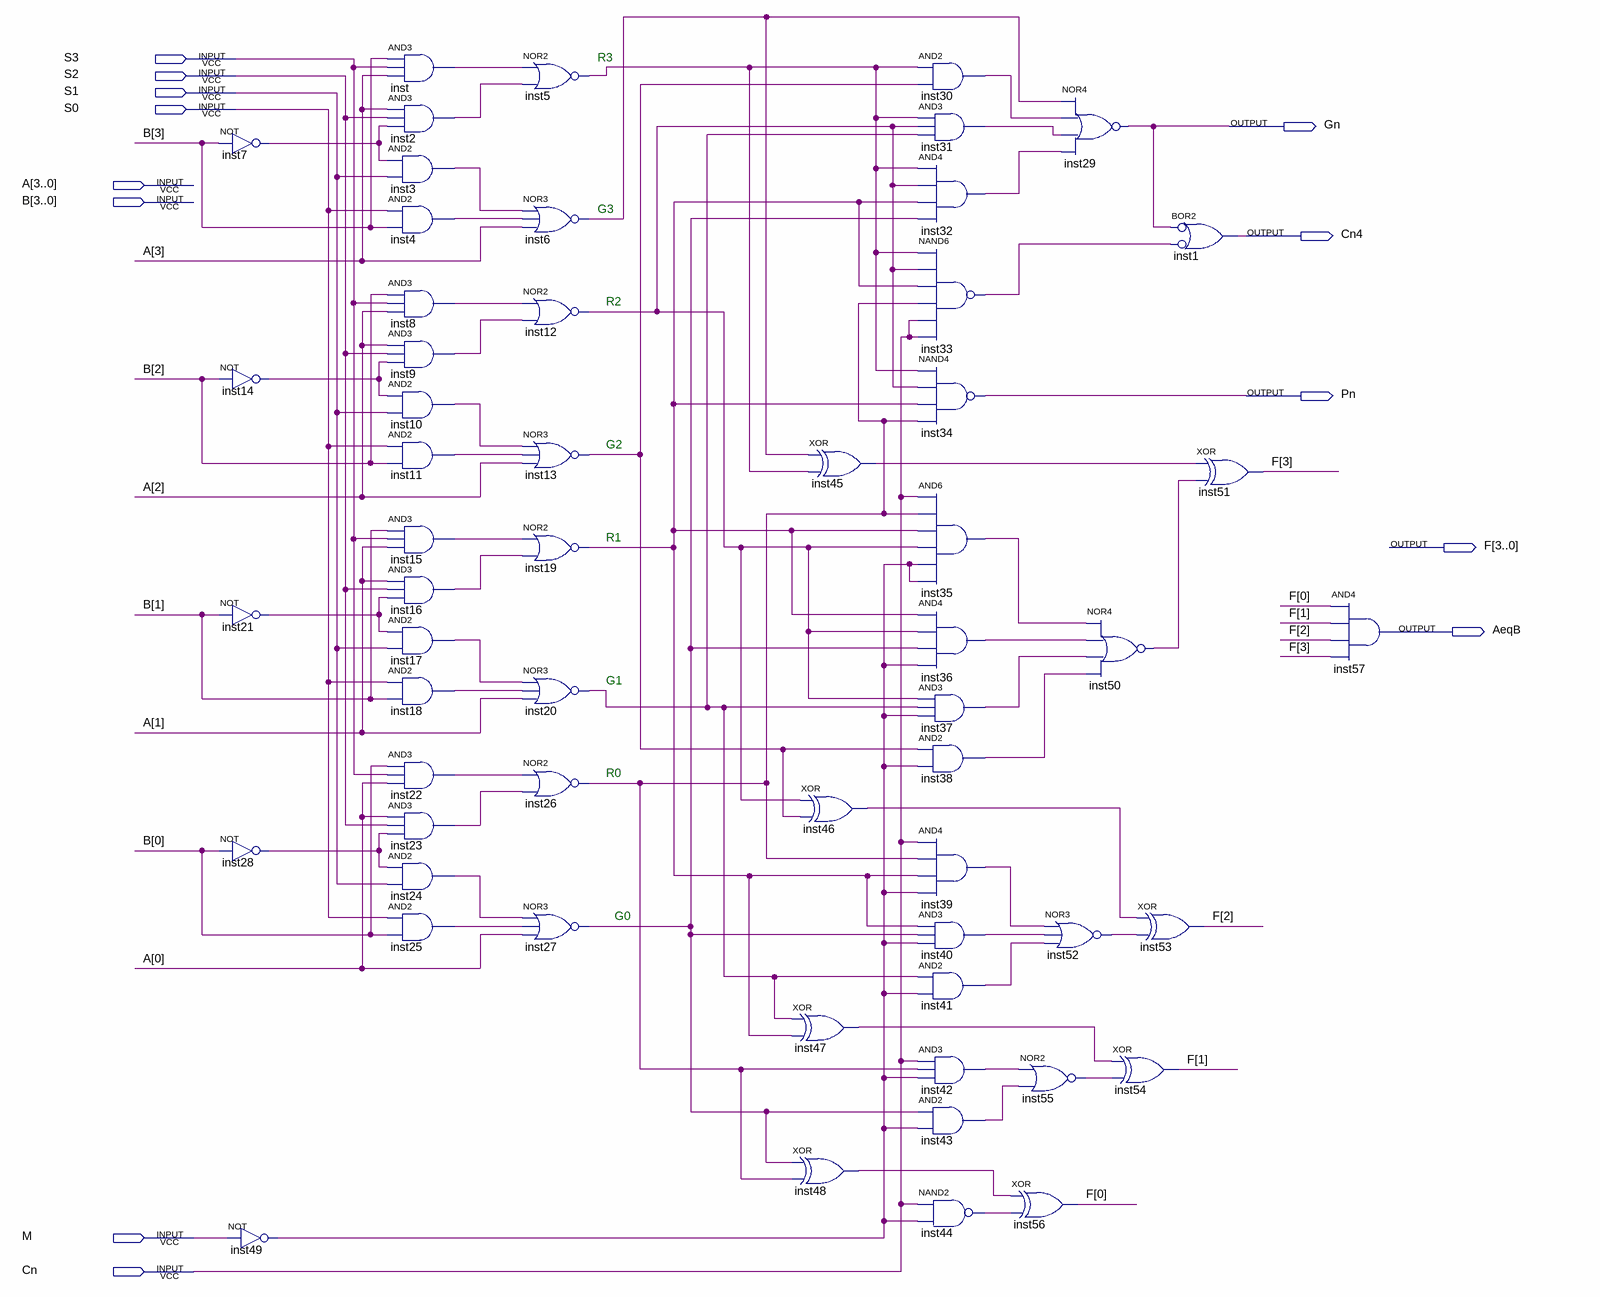
[diagram p0: schematic sheet]
// Quartus schematic ALUIP3.bdf as structural Verilog: 58 symbols, 13 pins
module ALUIP3 (
  input  S3,
  input  S2,
  input  S1,
  input  S0,
  input  [3:0] A,
  input  [3:0] B,
  input  M,
  input  Cn,
  output Gn,
  output Cn4,
  output Pn,
  output [3:0] F,
  output AeqB
);

  wire inst2_out, inst3_out, inst4_out, inst5_out, inst6_out, inst7_out, inst8_out, inst9_out, inst10_out,
       inst11_out, inst12_out, inst13_out, inst14_out, inst15_out, inst16_out, inst17_out, inst18_out,
       inst19_out, inst20_out, inst21_out, inst22_out, inst23_out, inst24_out, inst25_out, inst26_out,
       inst27_out, inst28_out, inst30_out, inst31_out, inst32_out, inst33_out, inst35_out, inst36_out,
       inst37_out, inst38_out, inst39_out, inst40_out, inst41_out, inst42_out, inst43_out, inst44_out,
       inst45_out, inst46_out, inst47_out, inst48_out, inst49_out, inst50_out, inst52_out, inst55_out,
       inst_out;

  not inst7 (inst7_out, B[3]);
  not inst14 (inst14_out, B[2]);
  not inst21 (inst21_out, B[1]);
  not inst28 (inst28_out, B[0]);
  not inst49 (inst49_out, M);
  and inst (inst_out, B[3], S3, A[3]);
  and inst2 (inst2_out, A[3], S2, inst7_out);
  and inst3 (inst3_out, inst7_out, S1);
  and inst4 (inst4_out, S0, B[3]);
  and inst8 (inst8_out, B[2], S3, A[2]);
  and inst9 (inst9_out, A[2], S2, inst14_out);
  and inst10 (inst10_out, inst14_out, S1);
  and inst11 (inst11_out, S0, B[2]);
  and inst15 (inst15_out, B[1], S3, A[1]);
  and inst16 (inst16_out, A[1], S2, inst21_out);
  and inst17 (inst17_out, inst21_out, S1);
  and inst18 (inst18_out, S0, B[1]);
  and inst22 (inst22_out, B[0], S3, A[0]);
  and inst23 (inst23_out, A[0], S2, inst28_out);
  and inst24 (inst24_out, inst28_out, S1);
  and inst25 (inst25_out, S0, B[0]);
  nor inst5 (inst5_out, inst_out, inst2_out);
  nor inst6 (inst6_out, inst3_out, inst4_out, A[3]);
  nor inst12 (inst12_out, inst8_out, inst9_out);
  nor inst13 (inst13_out, inst10_out, inst11_out, A[2]);
  nor inst19 (inst19_out, inst15_out, inst16_out);
  nor inst20 (inst20_out, inst17_out, inst18_out, A[1]);
  nor inst26 (inst26_out, inst22_out, inst23_out);
  nor inst27 (inst27_out, inst24_out, inst25_out, A[0]);
  xor inst45 (inst45_out, inst6_out, inst5_out);
  xor inst46 (inst46_out, inst12_out, inst13_out);
  xor inst47 (inst47_out, inst20_out, inst19_out);
  xor inst48 (inst48_out, inst27_out, inst26_out);
  and inst30 (inst30_out, inst5_out, inst13_out);
  and inst31 (inst31_out, inst5_out, inst12_out, inst20_out);
  and inst32 (inst32_out, inst5_out, inst12_out, inst19_out, inst27_out);
  nand inst33 (inst33_out, inst5_out, inst12_out, inst19_out, inst26_out, Cn, Cn);
  nand inst34 (Pn, inst5_out, inst12_out, inst19_out, inst26_out);
  and inst35 (inst35_out, Cn, inst26_out, inst19_out, inst12_out, inst49_out, inst49_out);
  and inst36 (inst36_out, inst19_out, inst12_out, inst27_out, inst49_out);
  and inst37 (inst37_out, inst12_out, inst20_out, inst49_out);
  and inst38 (inst38_out, inst13_out, inst49_out);
  and inst39 (inst39_out, Cn, inst26_out, inst19_out, inst49_out);
  and inst40 (inst40_out, inst19_out, inst27_out, inst49_out);
  and inst41 (inst41_out, inst20_out, inst49_out);
  and inst42 (inst42_out, Cn, inst26_out, inst49_out);
  and inst43 (inst43_out, inst27_out, inst49_out);
  nand inst44 (inst44_out, Cn, inst49_out);
  nor inst55 (inst55_out, inst42_out, inst43_out);
  xor inst56 (F[0], inst48_out, inst44_out);
  nor inst29 (Gn, inst6_out, inst30_out, inst31_out, inst32_out);
  nor inst50 (inst50_out, inst35_out, inst36_out, inst37_out, inst38_out);
  nor inst52 (inst52_out, inst39_out, inst40_out, inst41_out);
  or inst1 (Cn4, ~Gn, ~inst33_out);  // BOR2
  xor inst53 (F[2], inst46_out, inst52_out);
  xor inst54 (F[1], inst47_out, inst55_out);
  xor inst51 (F[3], inst45_out, inst50_out);
  and inst57 (AeqB, F[0], F[1], F[2], F[3]);

  // Notes on the sheet:
  //   R3
  //   G3
  //   R2
  //   G2
  //   R1
  //   G1
  //   R0
  //   G0
endmodule
